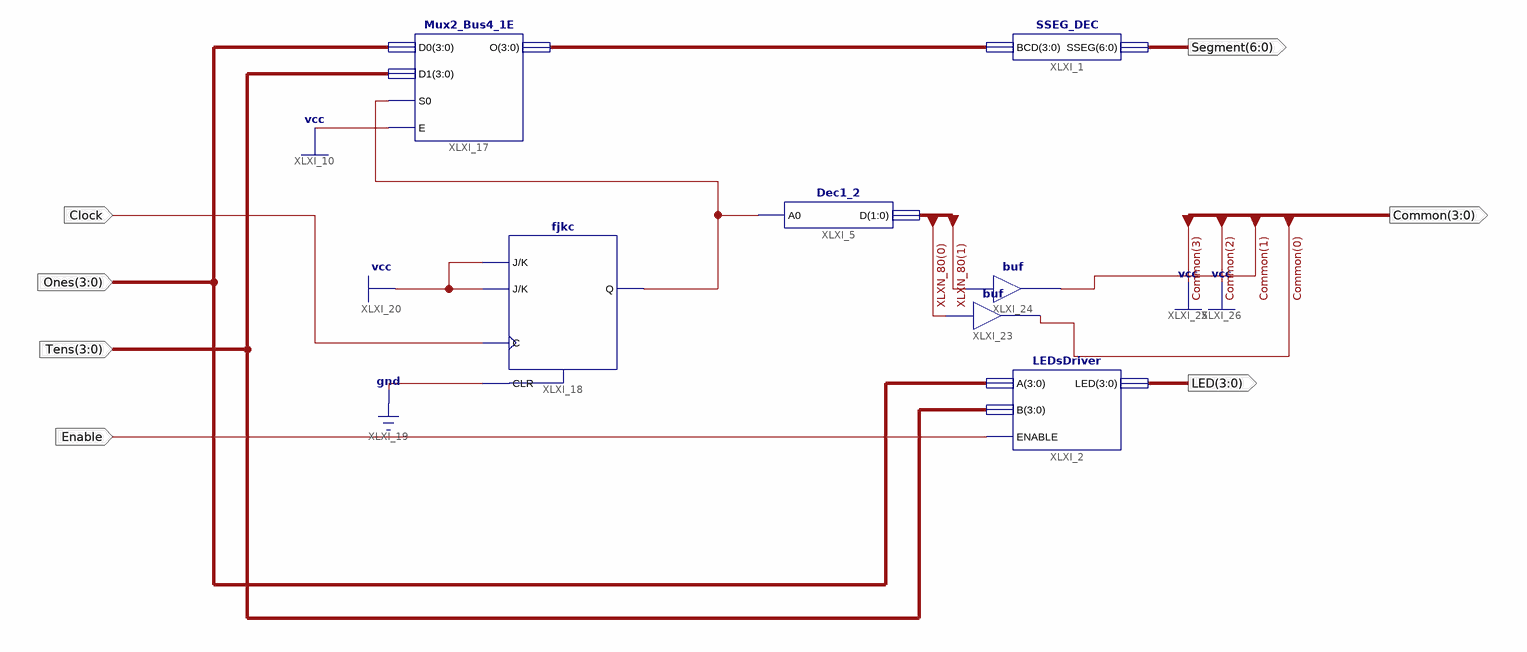
[diagram p0: schematic sheet 1]
// Xilinx ISE schematic Displayer.sch (spartan6) as structural Verilog: 7 symbols, 7 ports
module Displayer (
  input  [3:0] Ones,
  input  [3:0] Tens,
  input  Clock,
  input  Enable,
  output [3:0] LED,
  output [6:0] Segment,
  output [3:0] Common
);

  wire XLXN_68;
  wire [1:0] XLXN_80;
  wire [3:0] XLXN_60;

  LEDsDriver XLXI_2 (.A(Ones), .B(Tens), .ENABLE(Enable), .LED(LED));
  SSEG_DEC XLXI_1 (.BCD(XLXN_60), .SSEG(Segment));
  Dec1_2 XLXI_5 (.A0(XLXN_68), .D(XLXN_80));
  Mux2_Bus4_1E XLXI_17 (.D0(Ones), .D1(Tens), .S0(XLXN_68), .E(1'b1), .O(XLXN_60));
  fjkc XLXI_18 (.C(Clock), .CLR(1'b0), .J(1'b1), .K(1'b1), .Q(XLXN_68));
  buf XLXI_23 (Common[0], XLXN_80[0]);
  buf XLXI_24 (Common[1], XLXN_80[1]);

  assign Common[3:2] = 2'b11;
endmodule
